# Altium project MB1397.PrjPcb (part 9 of 9)

## Sheet USB-TYPEC_CON.SchDoc: USB-TYPEC_CON
size A4; Date: Not used; ApprovedBy: Not used; CheckedBy: Not used; Author: Not used; CompanyName: STMicroelectronics; DrawnBy: Not used; Engineer: Not used; Organization: Not used; Address1: Not used; Address2: Not used; Address3: Not used; Address4: Not used; DocumentNumber: Not used; Revision: Not used; SheetNumber: 6; SheetTotal: 22; CurrentTime: Not used; CurrentDate: Not used; Time: Not used; DocumentFullPathAndName: Not used; DocumentName: Not used; ModifiedDate: Not used; ImagePath: Not used; ProjectName: Not used; Application_BuildNumber: Not used
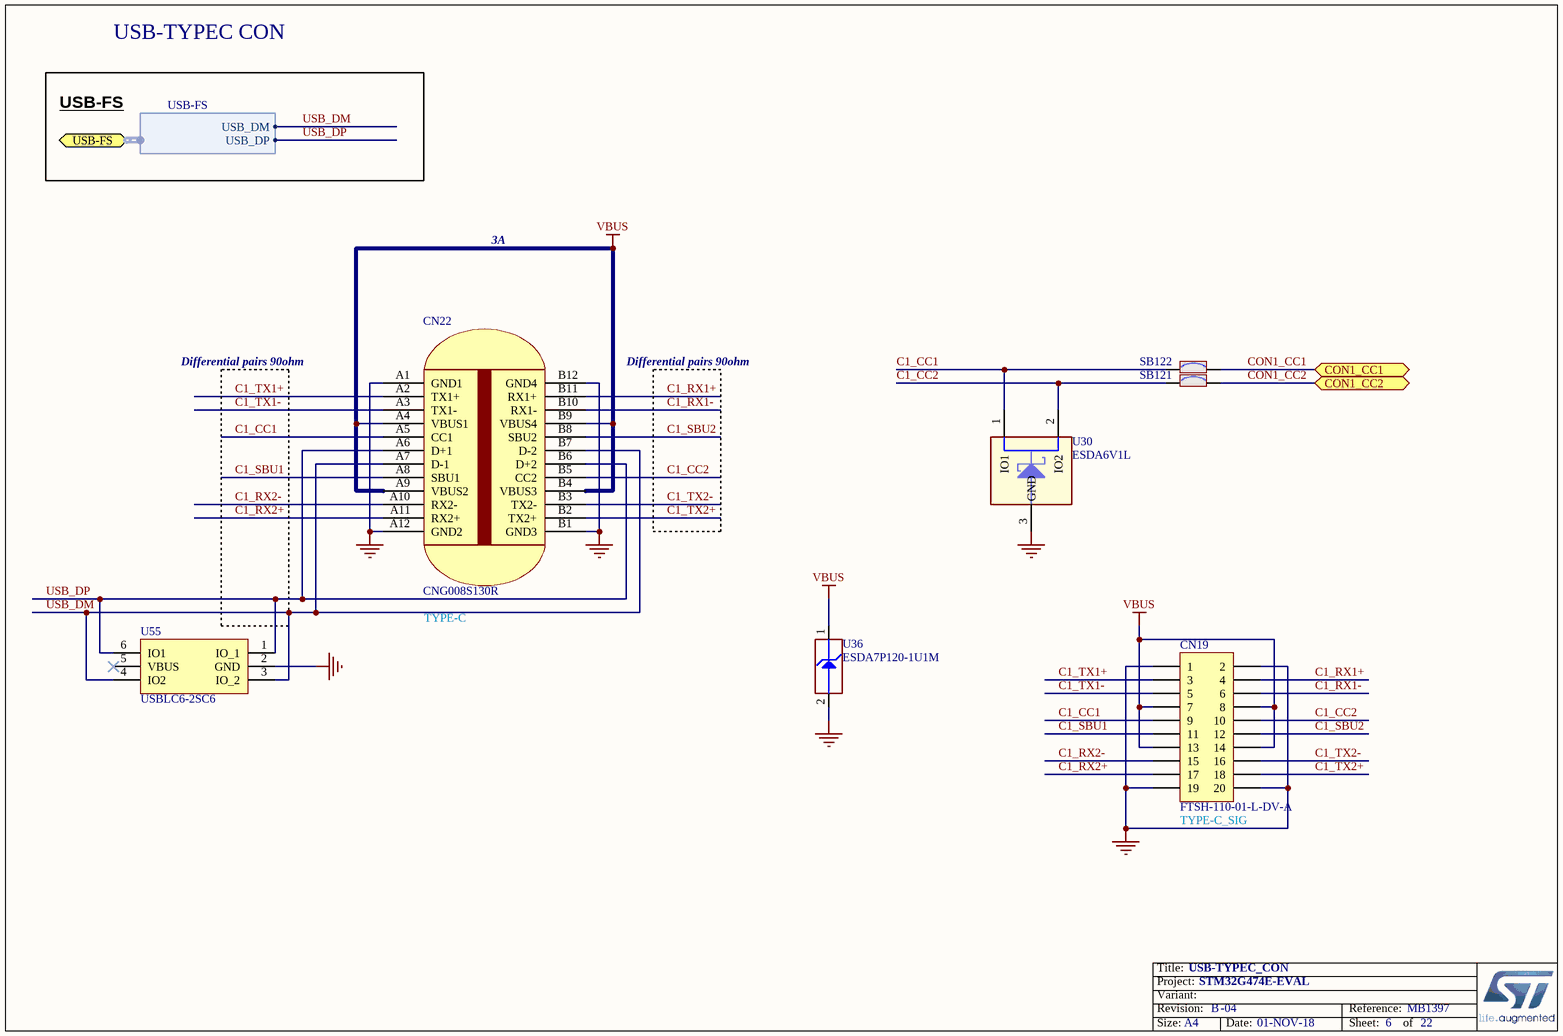
[diagram p21: USB-TYPEC_CON.SchDoc]

### Parts
CN19  value FTSH-110-01-L-DV-A  [CON_SAMTEC_FTSH-110-01-L-DV-A]  (hidden comment: Header 10x2)
CN22  value CNG008S130R  [CON_USB-TYPEC_LITKCONN-TECHNOLOGY_CNG008S130R]  (hidden comment: USB Type-C)
SB121  SB_ON  [SOLDER-BRIDGE_R0603-0R]  (value not drawn)
SB122  SB_ON  [SOLDER-BRIDGE_R0603-0R]  (value not drawn)
U30  value ESDA6V1L  [ESD_SOT23]  (hidden comment: ESDAxxL)
U36  value ESDA7P120-1U1M  [ESD_QFN1610_2N_1K_2A]  (hidden comment: ESD-TRANSIL)
U55  USBLC6-2SC6  [ESD_SOT23-6L]

### Ports
CON1_CC1, CON1_CC2, USB-FS (harness USB-FS)

### Harnesses
USB-FS: USB_DM, USB_DP

### Nets
GND: CN19.1 CN19.2 CN19.19 CN19.20 CN22.A1(GND1) CN22.A12(GND2) CN22.B1(GND3) CN22.B12(GND4) U30.3(GND) U36.2(GND) U55.2(GND)
VBUS: CN19.7 CN19.8 CN19.13 CN19.14 CN22.A4(VBUS1) CN22.A9(VBUS2) CN22.B4(VBUS3) CN22.B9(VBUS4) U36.1(IO1)
C1_CC1: CN19.9 CN22.A5(CC1) SB122.1 U30.1(IO1)
C1_CC2: CN19.10 CN22.B5(CC2) SB121.1 U30.2(IO2)
C1_RX1+: CN19.4 CN22.B11(RX1+)
C1_RX1-: CN19.6 CN22.B10(RX1-)
C1_RX2+: CN19.17 CN22.A11(RX2+)
C1_RX2-: CN19.15 CN22.A10(RX2-)
C1_SBU1: CN19.11 CN22.A8(SBU1)
C1_SBU2: CN19.12 CN22.B8(SBU2)
C1_TX1+: CN19.3 CN22.A2(TX1+)
C1_TX1-: CN19.5 CN22.A3(TX1-)
C1_TX2+: CN19.18 CN22.B2(TX2+)
C1_TX2-: CN19.16 CN22.B3(TX2-)
CON1_CC1: SB122.2 ; port CON1_CC1
CON1_CC2: SB121.2 ; port CON1_CC2
USB_DM: CN22.A7(D-1) CN22.B7(D-2) U55.3(IO_2) U55.4(IO2) ; port USB-FS.USB_DM
USB_DP: CN22.A6(D+1) CN22.B6(D+2) U55.1(IO_1) U55.6(IO1) ; port USB-FS.USB_DP

Not connected (* = marked no-connect by the designer): U55 5(VBUS)*

### Notes on the sheet
- USB-TYPEC CON
- USB-FS
- 3A
- Differential pairs 90ohm
- TYPE-C
- (near CN19) TYPE-C_SIG
- Title:
- Project:
- Size:
- Revision:
- Variant:
- A4
- -
- Date:
- Reference:
- Sheet:
- of

### Library data of the parts
CN19 = MCD-01561: Header 10x2, 1.27mm, VR, CMS, Height 3.05mm with alignment pin; Part_Type: Connector; Manufacturer: SAMTEC; Provided_By: SUBCO; Initial_Board_Reference: MB1397; Path: ws/MCD_ApplicationBoards/Lists/MCDPARTSdatabase; Item Type: Item; Remark: new part FTSH-110-01-L-DV-A to replace MCD-00557 footprint; Internal_Part_Number: MCD-01561; Status: New; Manufacturer_Part_Number: FTSH-110-01-L-DV-A; ComponentLink1Description: Datasheet; ComponentLink1URL: http://tunmcdsvn.tun.st.com/Component_Datasheet_Library/Trunk/Connectors/Samtec_FTSH_smt_series
CN22 = MCD-00678: USB Type C certified Connector SMT Mid-mount; Manufacturer: LITKCON TECHNOLOGY; Provided_By: SUBCO; Initial_Board_Reference: MB1272; Path: ws/MCD_ApplicationBoards/Lists/MCDPARTSdatabase; Item Type: Item; Internal_Part_Number: MCD-00678; Status: Footprint available; Part_Type: Connector; Manufacturer_Part_Number: CNG008S130R; ComponentLink1Description: Datasheet; ComponentLink1URL: http://tunmcdsvn.tun.st.com/Component_Datasheet_Library/Trunk/Connectors/LITKCON TECHNOLOGY_USBTypeC_CNG008S130R
SB121 SB122 = MCD-00071: Solder Bridge ON; Part_Type: Mechanical; Manufacturer_Part_Number: RC0603JR-070RL; Manufacturer: YAGEO; Provided_By: SUBCO; Initial_Board_Reference: MB1274; Path: ws/MCD_ApplicationBoards/Lists/MCDPARTSdatabase; Item Type: Item; Internal_Part_Number: MCD-00071; Status: Released; ComponentLink1Description: Datasheet; Package: SB0603; ComponentLink1URL: http://tunmcdsvn.tun.st.com/Component_Datasheet_Library/Trunk/Resistors/Yageo_Resistor_RC0603-series
U30 = MCD-00255: Dual Transil array ESD protection; Part_Type: Diode; Manufacturer: STMICROELECTRONICS; BMS_Part_Number: 9179033; Provided_By: SUBCO with ST control; Initial_Board_Reference: MB1311; Path: ws/MCD_ApplicationBoards/Lists/MCDPARTSdatabase; Item Type: Item; Internal_Part_Number: MCD-00255; Status: Released; Manufacturer_Part_Number: ESDA6V1L; ComponentLink1Description: Datasheet; ComponentLink1URL: http://tunmcdsvn.tun.st.com/Component_Datasheet_Library/Trunk/Diodes/STM_ESD_ESDAxxL
U36 = MCD-01026: High power transient voltage suppressor; Part_Type: Diode; Manufacturer: STMICROELECTRONICS; BMS_Part_Number: 9179046; Provided_By: SUBCO with ST control; Initial_Board_Reference: MB1378; Remark: Footprint moved fromROU lib: DFN105P160X60-2N to global-lib: ESD_QFN1610_2N_1K_2A; Path: ws/MCD_ApplicationBoards/Lists/MCDPARTSdatabase; Item Type: Item; Internal_Part_Number: MCD-01026; Status: Released; Manufacturer_Part_Number: ESDA7P120-1U1M; Package: QFN1610; ComponentLink1Description: Datasheet; ComponentLink1URL: http://tunmcdsvn.tun.st.com/Component_Datasheet_Library/Trunk/Diodes/STM_ESD_ESDA7P120-1U1M
U55 = MCD-00163: Very low capacitance ESD protection; Part_Type: IC; Manufacturer: STMICROELECTRONICS; BMS_Part_Number: 9151075; Provided_By: SUBCO with ST control; Initial_Board_Reference: MB1263; Path: ws/MCD_ApplicationBoards/Lists/MCDPARTSdatabase; Item Type: Item; Internal_Part_Number: MCD-00163; Value: USBLC6-2SC6; Status: Released; Manufacturer_Part_Number: USBLC6-2SC6; ComponentLink1Description: Datasheet; ComponentLink1URL: http://tunmcdsvn.tun.st.com/Component_Datasheet_Library/Trunk/Diodes/STM_ESD_USBLC6-2

## Nets that join several sheets
1V8: Audio (6 pins), Power_Board (SB42.2 TP4.1)
3V3: Audio (5 pins), LCD&SDcard (12 pins), MotorControl (10 pins), STM32_microcontroller_power (JP6.3 JP11.1), Power_Board (5 pins), Analog Interfaces (R111.2), Peripherals (LD1.1 LD2.1 LD3.1 LD4.1), RS232&RS485 (7 pins)
5V: FDCAN (C44.1 C53.1 U10.3 U15.3), LCD&SDcard (SB46.1), MotorControl (CN2.25 CN4.25), SmartCard (C152.1 C153.2 U42.6), Power_Board (11 pins), Analog Interfaces (C159.2 Q4.3 R318.2 U4.8), Multi-Function Expander (R241.2 T8.4), Peripherals (SB1.2 SB34.2), STLink_V3E_SWD (R277.2), ExtensionConnector (CN5.60 CN6.60)
5V_D: Power_Board (JP12.5), STLink_V3E_SWD (D4.1), ExtensionConnector (CN5.49 CN6.49)
5V_EXT: Power_Board (8 pins), STLink_V3E_SWD (D3.1), USB_PD (5 pins)
5V_STLK: Power_Board (JP12.1), STLink_V3E_SWD (SB41.2)
5V_USB_CHGR: Power_Board (JP12.9), STLink_V3E_SWD (8 pins)
5V_USB_PD: Power_Board (JP12.3), STLink_V3E_SWD (D5.1), USB_PD (D8.2 D9.2)
AGND: STM32_microcontroller_power (10 pins), Analog Interfaces (35 pins)
GND: FMC Memory (7 pins), Audio (33 pins), QSPI Memory (C51.1 C184.1 U12.10 U54.10), FDCAN (10 pins), LCD&SDcard (23 pins), MotorControl (49 pins), SmartCard (15 pins), STM32_microcontroller_power (33 pins), Power_Board (31 pins), HW_Mechanical_Parts (H1.1 H2.1 H5.1 H6.1), Analog Interfaces (5 pins), Multi-Function Expander (26 pins), Peripherals (17 pins), STLink_V3E_SWD (97 pins), ExtensionConnector (7 pins), USB_PD (10 pins), Debug connector (26 pins), RS232&RS485 (14 pins), USB-TYPEC_CON (11 pins)
VBUS: USB_PD (10 pins), USB-TYPEC_CON (9 pins)
VDD: STM32_microcontroller_IOs (R73.2 R80.2), FMC Memory (7 pins), Audio (5 pins), QSPI Memory (6 pins), FDCAN (C40.1 C52.1 U10.5 U15.5), LCD&SDcard (8 pins), SmartCard (8 pins), STM32_microcontroller_power (JP7.1 JP11.2 SW7.2), Analog Interfaces (C50.1 R158.2 R179.2 RV2.1), Multi-Function Expander (11 pins), Peripherals (6 pins), STLink_V3E_SWD (CN16.3 R282.2), ExtensionConnector (CN5.48 CN6.48), Debug connector (9 pins), RS232&RS485 (5 pins)
VDD_ADJ: STM32_microcontroller_power (JP11.3), Power_Board (SB48.2)
VDD_MCU: STM32_microcontroller_power (18 pins), Multi-Function Expander (JP13.2 SB43.2)
VREF_EXT: STM32_microcontroller_power (SB84.1), Analog Interfaces (5 pins)
A0: STM32_microcontroller_IOs (R136.2), FMC Memory (U11.A3), ExtensionConnector (CN6.51)
A1: STM32_microcontroller_IOs (R138.2), FMC Memory (U11.A4), ExtensionConnector (CN6.54)
A2: STM32_microcontroller_IOs (R132.2), FMC Memory (U11.A5), ExtensionConnector (CN6.46)
A3: STM32_microcontroller_IOs (R139.2), FMC Memory (U11.B3), ExtensionConnector (CN6.58)
A4: STM32_microcontroller_IOs (R140.2), FMC Memory (U11.B4), ExtensionConnector (CN6.57)
A5: STM32_microcontroller_IOs (R137.2), FMC Memory (U11.C3), ExtensionConnector (CN6.53)
A6: STM32_microcontroller_IOs (R93.2), FMC Memory (U11.C4), ExtensionConnector (CN6.30)
A7: STM32_microcontroller_IOs (R89.2), FMC Memory (U11.D4), ExtensionConnector (CN6.29)
A8: STM32_microcontroller_IOs (R88.2), FMC Memory (U11.H2), ExtensionConnector (CN6.28)
A9: STM32_microcontroller_IOs (R87.2), FMC Memory (U11.H3), ExtensionConnector (CN6.26)
A10: STM32_microcontroller_IOs (R48.2), FMC Memory (U11.H4), ExtensionConnector (CN5.22)
A11: STM32_microcontroller_IOs (R28.2), FMC Memory (U11.H5), ExtensionConnector (CN5.21)
A12: STM32_microcontroller_IOs (R50.2), FMC Memory (U11.G3), ExtensionConnector (CN5.18)
A13: STM32_microcontroller_IOs (R27.2), FMC Memory (U11.G4), ExtensionConnector (CN5.19)
A14: STM32_microcontroller_IOs (R53.2), FMC Memory (U11.F3), ExtensionConnector (CN5.17)
A15: STM32_microcontroller_IOs (R68.2), FMC Memory (U11.F4), ExtensionConnector (CN5.16)
A16: STM32_microcontroller_IOs (R39.2), FMC Memory (U11.E4), ExtensionConnector (CN6.7)
A17: STM32_microcontroller_IOs (R42.2), FMC Memory (U11.D3), ExtensionConnector (CN6.6)
A18: STM32_microcontroller_IOs (R41.2), FMC Memory (U11.H1), ExtensionConnector (CN6.5)
A19: STM32_microcontroller_IOs (R146.1), FMC Memory (R156.2 U11.G2), ExtensionConnector (CN5.54)
A20: STM32_microcontroller_IOs (R143.1), FMC Memory (R162.2 U11.H6), ExtensionConnector (CN5.56)
ADC_OUTN: STM32_microcontroller_IOs (SB27.1), Analog Interfaces (C35.1 R152.2)
Audio_INT: STM32_microcontroller_IOs (R43.2), Audio (U35.G3)
BK_Drive: STM32_microcontroller_IOs (R26.1), Peripherals (R175.1)
BOOT0: STM32_microcontroller_IOs (R123.1), STM32_microcontroller_power (JP8.2 R182.1)
CON1_CC1: STM32_microcontroller_IOs (SB21.2), USB_PD (JP15.3), USB-TYPEC_CON (SB122.2)
CON1_CC2: STM32_microcontroller_IOs (SB96.2), USB_PD (JP14.3), USB-TYPEC_CON (SB121.2)
D0: STM32_microcontroller_IOs (R29.2), FMC Memory (U11.B6), ExtensionConnector (CN6.4)
D1: STM32_microcontroller_IOs (R40.2), FMC Memory (U11.C5), ExtensionConnector (CN6.3)
D2: STM32_microcontroller_IOs (R83.2), FMC Memory (U11.C6), ExtensionConnector (CN5.27)
D3: STM32_microcontroller_IOs (R85.2), FMC Memory (U11.D5), ExtensionConnector (CN5.28)
D4: STM32_microcontroller_IOs (R84.1), FMC Memory (U11.E5), ExtensionConnector (CN6.27)
D5: STM32_microcontroller_IOs (R82.1), FMC Memory (U11.F5), ExtensionConnector (CN6.25)
D6: STM32_microcontroller_IOs (R79.1), FMC Memory (U11.F6), ExtensionConnector (CN6.24)
D7: STM32_microcontroller_IOs (R75.1), FMC Memory (U11.G6), ExtensionConnector (CN6.23)
D8: STM32_microcontroller_IOs (R71.1), FMC Memory (U11.B1), ExtensionConnector (CN6.22)
D9: STM32_microcontroller_IOs (R69.1), FMC Memory (U11.C1), ExtensionConnector (CN6.21)
D10: STM32_microcontroller_IOs (R63.1), FMC Memory (U11.C2), ExtensionConnector (CN6.20)
D11: STM32_microcontroller_IOs (R62.1), FMC Memory (U11.D2), ExtensionConnector (CN6.19)
D12: STM32_microcontroller_IOs (R60.1), FMC Memory (U11.E2), ExtensionConnector (CN6.18)
D13: STM32_microcontroller_IOs (R34.2), FMC Memory (U11.F2), ExtensionConnector (CN6.12)
D14: STM32_microcontroller_IOs (R37.2), FMC Memory (U11.F1), ExtensionConnector (CN6.9)
D15: STM32_microcontroller_IOs (R38.2), FMC Memory (U11.G1), ExtensionConnector (CN6.8)
DAC: STM32_microcontroller_IOs (SB25.1), Analog Interfaces (R153.2)
DISCHARGE: STM32_microcontroller_IOs (SB18.2), USB_PD (SB44.1)
FDCAN1_RX: STM32_microcontroller_IOs (JP1.2), FDCAN (U15.4)
FDCAN1_TX: STM32_microcontroller_IOs (R127.2), FDCAN (U15.1)
FDCAN2_RX: STM32_microcontroller_IOs (R112.2), FDCAN (U10.4)
FDCAN2_TX: STM32_microcontroller_IOs (SB5.2), FDCAN (U10.1)
FMC_NBL0: STM32_microcontroller_IOs (R148.1), FMC Memory (U11.A1), ExtensionConnector (CN5.55)
FMC_NBL1: STM32_microcontroller_IOs (R149.1), FMC Memory (U11.B2), ExtensionConnector (CN5.53)
FMC_NE1: STM32_microcontroller_IOs (R101.2), FMC Memory (R171.1 U11.B5), ExtensionConnector (CN5.40)
FMC_NOE: STM32_microcontroller_IOs (R94.2), FMC Memory (U11.A2), ExtensionConnector (CN5.33)
FMC_NWE: STM32_microcontroller_IOs (R97.2), FMC Memory (U11.G5), ExtensionConnector (CN5.38)
I2C3_SCL: STM32_microcontroller_IOs (R73.1 R74.2), Multi-Function Expander (R243.1), Peripherals (CN1.3 R17.1 U1.1 U1.6)
I2C3_SDA: STM32_microcontroller_IOs (R78.2 R80.1), Multi-Function Expander (R239.1), Peripherals (CN1.1 R13.1 U1.3 U1.4)
I2C3_SMBA: STM32_microcontroller_IOs (R70.2), Peripherals (R15.1 R16.1)
JTCK-SWCLK: STM32_microcontroller_IOs (R47.1), STLink_V3E_SWD (CN29.1 R206.2 U40.M11), Debug connector (R193.2)
JTDI: STM32_microcontroller_IOs (R54.1), STLink_V3E_SWD (R199.2), Debug connector (R185.2)
JTDO-SWO: STM32_microcontroller_IOs (R107.2), STLink_V3E_SWD (R204.2 U40.D12), Debug connector (R209.2)
JTMS-SWDIO: STM32_microcontroller_IOs (R44.1), STLink_V3E_SWD (CN29.2 R208.2 R285.2 U40.L2), Debug connector (R188.2)
JTRST: STM32_microcontroller_IOs (R109.1), Debug connector (R205.2)
LCD_CS: STM32_microcontroller_IOs (R49.1), LCD&SDcard (R216.1)
LED1: STM32_microcontroller_IOs (R81.2), Peripherals (R297.2)
LED3: STM32_microcontroller_IOs (R96.2), Peripherals (R299.2)
MC1_Ain: STM32_microcontroller_IOs (SB113.1), MotorControl (R64.2)
MC1_Bin: STM32_microcontroller_IOs (SB114.1), MotorControl (R55.2)
MC1_BusVoltage: STM32_microcontroller_IOs (SB115.1), MotorControl (C4.1 R3.2)
MC1_Cin: STM32_microcontroller_IOs (SB99.1), MotorControl (R52.2)
MC1_DissipativeBrake: STM32_microcontroller_IOs (SB97.1), MotorControl (CN2.23)
MC1_EnA: STM32_microcontroller_IOs (SB98.1), MotorControl (C3.2 CN2.31 SB2.1)
MC1_EnB: STM32_microcontroller_IOs (SB89.1), MotorControl (C9.2 CN2.33)
MC1_EnIndex: STM32_microcontroller_IOs (SB62.1 SB92.1), MotorControl (C11.2 CN2.34)
MC1_ICL_SHUTOUT: STM32_microcontroller_IOs (SB109.1), MotorControl (CN2.21)
MC1_MC2_PFC_Ind: STM32_microcontroller_IOs (SB55.1), MotorControl (C7.2 C29.2 R5.2 R113.2)
MC1_MC2_PFC_SD: STM32_microcontroller_IOs (SB17.1), MotorControl (R10.2 R128.2)
MC1_MC2_PFC_Vac: STM32_microcontroller_IOs (SB56.1), MotorControl (C10.2 C34.2 R12.2 R155.2)
MC1_MC2_PFCpwm: STM32_microcontroller_IOs (SB118.1), MotorControl (R11.1 R151.1)
MC1_MC2_PFCsync: STM32_microcontroller_IOs (SB103.1), MotorControl (R8.1 R126.1)
MC1_PWM_1H: STM32_microcontroller_IOs (SB78.1), MotorControl (CN2.3)
MC1_PWM_1L: STM32_microcontroller_IOs (SB79.1), MotorControl (CN2.5)
MC1_PWM_2H: STM32_microcontroller_IOs (SB76.1), MotorControl (CN2.7)
MC1_PWM_2L: STM32_microcontroller_IOs (SB77.1), MotorControl (CN2.9)
MC1_PWM_3H: STM32_microcontroller_IOs (SB73.1), MotorControl (CN2.11)
MC1_PWM_3L: STM32_microcontroller_IOs (SB74.1), MotorControl (CN2.13)
MC1_STOP: STM32_microcontroller_IOs (SB69.1), MotorControl (C1.2 CN2.1 R9.1)
MC1_Temp: STM32_microcontroller_IOs (SB100.1), MotorControl (C5.2 R7.2)
MC2_Ain: STM32_microcontroller_IOs (SB60.1), MotorControl (R103.2)
MC2_Bin: STM32_microcontroller_IOs (SB59.1), MotorControl (R99.2)
MC2_BusVoltage: STM32_microcontroller_IOs (SB72.1), MotorControl (C22.1 R77.2)
MC2_Cin: STM32_microcontroller_IOs (SB57.1), MotorControl (R119.2)
MC2_DissipativeBrake: STM32_microcontroller_IOs (SB112.1), MotorControl (CN4.23)
MC2_EnA: STM32_microcontroller_IOs (SB52.1), MotorControl (C37.2 CN4.31 SB32.1)
MC2_EnB: STM32_microcontroller_IOs (SB108.1), MotorControl (C42.2 CN4.33)
MC2_EnIndex: STM32_microcontroller_IOs (SB58.1 SB106.1), MotorControl (C39.2 CN4.34)
MC2_ICL_SHUTOUT: STM32_microcontroller_IOs (SB61.1), MotorControl (CN4.21)
MC2_PWM_1H: STM32_microcontroller_IOs (SB49.1), MotorControl (CN4.3)
MC2_PWM_1L: STM32_microcontroller_IOs (SB64.1), MotorControl (CN4.5)
MC2_PWM_2H: STM32_microcontroller_IOs (SB50.1), MotorControl (CN4.7)
MC2_PWM_2L: STM32_microcontroller_IOs (SB68.1), MotorControl (CN4.9)
MC2_PWM_3H: STM32_microcontroller_IOs (SB51.1), MotorControl (CN4.11)
MC2_PWM_3L: STM32_microcontroller_IOs (SB66.1), MotorControl (CN4.13)
MC2_STOP: STM32_microcontroller_IOs (SB23.1), MotorControl (R21.1)
MC2_Temp: STM32_microcontroller_IOs (SB83.1), MotorControl (C31.2 R120.2)
MC_DAC_OUT1: STM32_microcontroller_IOs (SB93.1), MotorControl (SW3.3 SW3.6 SW4.2)
MC_DAC_OUT2: STM32_microcontroller_IOs (SB24.1), MotorControl (CN32.1)
MFX_JOY_DOWN: Multi-Function Expander (U32.19), Peripherals (B1.3 U49.4)
MFX_JOY_LEFT: Multi-Function Expander (U32.20), Peripherals (B1.1 U49.6)
MFX_JOY_RIGHT: Multi-Function Expander (U32.39), Peripherals (B1.6 U49.3)
MFX_JOY_SEL: Multi-Function Expander (U32.18), Peripherals (B1.2 U49.5)
MFX_JOY_UP: Multi-Function Expander (U32.40), Peripherals (B1.4 U49.1)
MFX_SmartCard_1V8: SmartCard (R275.1 R276.2 U42.18), Multi-Function Expander (U32.29)
MFX_SmartCard_3/5V: SmartCard (U42.3), Multi-Function Expander (U32.30)
MFX_SmartCard_CMDVCC: SmartCard (U42.19), Multi-Function Expander (U32.32)
MFX_SmartCard_OFF: SmartCard (U42.23), Multi-Function Expander (U32.31)
MFX_SmartCard_RST: SmartCard (U42.20), Multi-Function Expander (U32.33)
NetC49_2: STM32_microcontroller_IOs (SB10.2), Peripherals (C49.2 R172.2)
NetC171_2: STM32_microcontroller_IOs (SB116.2), Analog Interfaces (C171.2 R310.2)
NetD2_1: STM32_microcontroller_power (D2.1), RS232&RS485 (U17.20)
NetJP18_2: STM32_microcontroller_power (JP18.2), RS232&RS485 (U17.16)
NetR312_1: STM32_microcontroller_power (R312.1), STLink_V3E_SWD (U40.F15)
NRST: STM32_microcontroller_IOs (U6.21), STM32_microcontroller_power (5 pins), Multi-Function Expander (D7.2), STLink_V3E_SWD (R196.2 U40.P3), ExtensionConnector (R309.2)
OPAMP1_INN: STM32_microcontroller_IOs (SB105.1), MotorControl (C20.1 R65.2 R67.2)
OPAMP1_INP: STM32_microcontroller_IOs (SB95.1), MotorControl (R61.2)
OPAMP1_OUT: STM32_microcontroller_IOs (SB117.1), MotorControl (C20.2 R67.1)
OPAMP2_IN1P: STM32_microcontroller_IOs (SB101.1), MotorControl (R31.2)
OPAMP2_IN2P: STM32_microcontroller_IOs (SB70.1), MotorControl (C15.1 R24.2 R25.1)
OPAMP2_INN: STM32_microcontroller_IOs (SB20.1), MotorControl (C19.1 R56.2 R57.2)
OPAMP2_OUT: STM32_microcontroller_IOs (SB104.1), MotorControl (C19.2 R57.1)
OPAMP3_INN: STM32_microcontroller_IOs (SB80.1), MotorControl (C27.1 R105.2 R106.2)
OPAMP3_INP: STM32_microcontroller_IOs (SB94.1), MotorControl (R125.2)
OPAMP3_OUT: STM32_microcontroller_IOs (SB91.1), MotorControl (C27.2 R105.1)
OPAMP4/COMP6_INP: STM32_microcontroller_IOs (SB8.2), Analog Interfaces (R164.1)
OPAMP4_IN1P: STM32_microcontroller_IOs (SB67.1), MotorControl (C14.1 R20.1 R22.2)
OPAMP4_IN2P: STM32_microcontroller_IOs (SB63.1), MotorControl (R91.2)
OPAMP4_INN: STM32_microcontroller_IOs (SB71.1), MotorControl (C17.1 R32.2 R33.2)
OPAMP4_OUT: STM32_microcontroller_IOs (SB65.1), MotorControl (C17.2 R33.1)
OPAMP4_VOUT: STM32_microcontroller_IOs (SB7.2), Analog Interfaces (RV1.2 RV1.3 TP2.1)
PA0: STM32_microcontroller_IOs (SB26.2 SB98.2 SB116.1 U6.27), ExtensionConnector (CN6.45)
PA1: STM32_microcontroller_IOs (SB27.2 SB95.2 U6.28), ExtensionConnector (CN6.44)
PA4: STM32_microcontroller_IOs (SB25.2 SB93.2 U6.33), ExtensionConnector (CN6.41)
PA5: STM32_microcontroller_IOs (SB24.2 U6.34), ExtensionConnector (CN6.40)
PA8: STM32_microcontroller_IOs (R30.2 U6.89), ExtensionConnector (CN5.2)
PA9: STM32_microcontroller_IOs (SB4.2 SB54.2 U6.90), ExtensionConnector (CN5.8)
PA10: STM32_microcontroller_IOs (SB3.2 SB53.2 U6.91), ExtensionConnector (CN5.4)
PA11: STM32_microcontroller_IOs (R46.2 U6.92), ExtensionConnector (CN5.3)
PA12: STM32_microcontroller_IOs (R45.2 U6.93), ExtensionConnector (CN5.5)
PA13: STM32_microcontroller_IOs (R44.2 U6.96), ExtensionConnector (CN5.6)
PA14: STM32_microcontroller_IOs (R47.2 U6.98), ExtensionConnector (CN5.9)
PA15: STM32_microcontroller_IOs (R54.2 SB62.2 U6.99), ExtensionConnector (CN5.12)
PB2: STM32_microcontroller_IOs (SB18.1 SB80.2 U6.41), ExtensionConnector (CN6.32)
PB3: STM32_microcontroller_IOs (R107.1 U6.118), ExtensionConnector (CN5.41)
PB4: STM32_microcontroller_IOs (R109.2 SB96.1 U6.119), ExtensionConnector (CN5.42)
PB5: STM32_microcontroller_IOs (R112.1 U6.120), ExtensionConnector (CN5.43)
PB6: STM32_microcontroller_IOs (SB21.1 U6.121), ExtensionConnector (CN5.44)
PB7: STM32_microcontroller_IOs (SB23.2 U6.122), ExtensionConnector (CN5.47)
PB8: STM32_microcontroller_IOs (JP1.1 R123.2 U6.123), ExtensionConnector (CN5.52)
PB9: STM32_microcontroller_IOs (R127.1 U6.124), ExtensionConnector (CN5.51)
PB10: STM32_microcontroller_IOs (SB11.1 SB71.2 U6.62), ExtensionConnector (CN6.17)
PB11: STM32_microcontroller_IOs (SB8.1 SB10.1 SB67.2 U6.65), ExtensionConnector (CN6.15)
PB12: STM32_microcontroller_IOs (SB7.1 SB65.2 U6.66), ExtensionConnector (CN6.16)
PB13: STM32_microcontroller_IOs (SB5.1 SB63.2 U6.67), ExtensionConnector (CN6.13)
PB14: STM32_microcontroller_IOs (R35.1 U6.68), ExtensionConnector (CN6.11)
PB15: STM32_microcontroller_IOs (R36.1 U6.69), ExtensionConnector (CN6.14)
PC0: STM32_microcontroller_IOs (SB29.2 SB99.2 U6.22), ExtensionConnector (CN5.46)
PC5: STM32_microcontroller_IOs (SB20.2 U6.38), ExtensionConnector (CN6.34)
PC6: STM32_microcontroller_IOs (SB9.2 SB49.2 U6.80), ExtensionConnector (CN6.2)
PC7: STM32_microcontroller_IOs (SB6.2 SB50.2 U6.81), ExtensionConnector (CN6.1)
PC8: STM32_microcontroller_IOs (R26.2 SB51.2 U6.87), ExtensionConnector (CN5.1)
PC9: STM32_microcontroller_IOs (R49.2 U6.88), ExtensionConnector (CN5.11)
PC10: STM32_microcontroller_IOs (SB12.2 SB64.2 U6.100), ExtensionConnector (CN5.13)
PC11: STM32_microcontroller_IOs (SB13.2 SB68.2 U6.101), ExtensionConnector (CN5.15)
PC12: STM32_microcontroller_IOs (SB15.2 SB66.2 U6.102), ExtensionConnector (CN5.14)
PC13: STM32_microcontroller_IOs (R141.2 U6.7), ExtensionConnector (CN5.57)
PC14: STM32_microcontroller_IOs (U6.8), STM32_microcontroller_power (R315.2), ExtensionConnector (SB88.1)
PC15: STM32_microcontroller_IOs (U6.9), STM32_microcontroller_power (R314.2), ExtensionConnector (SB87.2)
PD2: STM32_microcontroller_IOs (SB17.2 SB123.1 U6.112), ExtensionConnector (CN5.29)
PD6: STM32_microcontroller_IOs (R98.1 U6.116), ExtensionConnector (CN5.37)
PD_DBCC1: STM32_microcontroller_IOs (SB54.1), USB_PD (JP15.2)
PD_DBCC2: STM32_microcontroller_IOs (SB53.1), USB_PD (JP14.2)
PE2: STM32_microcontroller_IOs (R147.2 SB103.2 SB111.2 U6.1), ExtensionConnector (CN5.50)
PE5: STM32_microcontroller_IOs (SB28.2 SB97.2 U6.4), ExtensionConnector (CN5.45)
PE6: STM32_microcontroller_IOs (R142.2 U6.5), ExtensionConnector (CN5.58)
PF0: STM32_microcontroller_IOs (U6.19), STM32_microcontroller_power (C172.1 R312.2 R317.2), ExtensionConnector (SB82.1)
PF1: STM32_microcontroller_IOs (U6.20), STM32_microcontroller_power (R313.2), ExtensionConnector (SB81.2)
PF6: STM32_microcontroller_IOs (R43.1 SB52.2 U6.97), ExtensionConnector (CN5.7)
PF8: STM32_microcontroller_IOs (R135.1 SB106.2 U6.16), ExtensionConnector (CN6.56)
PF9: STM32_microcontroller_IOs (R134.1 U6.17), ExtensionConnector (CN6.55)
PF11: STM32_microcontroller_IOs (R96.1 U6.48), ExtensionConnector (CN6.31)
PG6: STM32_microcontroller_IOs (R70.1 U6.104), ExtensionConnector (CN5.24)
PG7: STM32_microcontroller_IOs (R74.1 U6.105), ExtensionConnector (CN5.23)
PG8: STM32_microcontroller_IOs (R78.1 U6.106), ExtensionConnector (CN5.25)
PG9: STM32_microcontroller_IOs (R81.1 U6.107), ExtensionConnector (CN5.26)
QSPI_BK1_IO0: STM32_microcontroller_IOs (R102.2), QSPI Memory (R173.2), ExtensionConnector (CN6.33)
QSPI_BK1_IO1: STM32_microcontroller_IOs (R108.2), QSPI Memory (R159.1), ExtensionConnector (CN6.35)
QSPI_BK1_IO2: STM32_microcontroller_IOs (R118.1), QSPI Memory (R160.2), ExtensionConnector (CN6.37)
QSPI_BK1_IO3: STM32_microcontroller_IOs (R121.1), QSPI Memory (R178.1), ExtensionConnector (CN6.38)
QSPI_BK1_NCS: STM32_microcontroller_IOs (R150.1), QSPI Memory (R161.2 SB35.1 U12.7), ExtensionConnector (CN6.43)
QSPI_BK2_IO0: STM32_microcontroller_IOs (R130.1), QSPI Memory (R170.2 R320.2), ExtensionConnector (CN6.52)
QSPI_BK2_IO1: STM32_microcontroller_IOs (R133.1), QSPI Memory (R168.1 R321.1), ExtensionConnector (CN6.50)
QSPI_BK2_IO2: STM32_microcontroller_IOs (R131.1), QSPI Memory (R167.2 R322.2), ExtensionConnector (CN6.47)
QSPI_BK2_IO3: STM32_microcontroller_IOs (R116.1), QSPI Memory (R169.1 R319.1), ExtensionConnector (CN6.36)
QSPI_BK2_NCS: STM32_microcontroller_IOs (R90.2), QSPI Memory (R166.2 SB120.1 U54.7), ExtensionConnector (CN5.34)
QSPI_CLK: STM32_microcontroller_IOs (R129.1), QSPI Memory (SB36.2 SB119.2 U12.16), ExtensionConnector (CN6.42)
RS485_DIR: STM32_microcontroller_IOs (SB123.2), RS232&RS485 (R201.1 U23.3)
SAI_FS_A: STM32_microcontroller_IOs (SB107.1), Audio (U35.E3)
SAI_MCLK_A: STM32_microcontroller_IOs (SB111.1), Audio (U35.D3)
SAI_SCK_A: STM32_microcontroller_IOs (R30.1), Audio (U35.G1)
SAI_SD_A: STM32_microcontroller_IOs (R98.2), Audio (U35.E4)
SAI_SD_B: STM32_microcontroller_IOs (SB110.1), Audio (U35.F2)
SmartCard_CLK: STM32_microcontroller_IOs (SB15.1), SmartCard (U42.24)
SmartCard_IO: STM32_microcontroller_IOs (SB12.1), SmartCard (U42.26)
SOURCE_EN: STM32_microcontroller_IOs (SB13.1), USB_PD (R264.2 T10.3)
SPI2_MISO: STM32_microcontroller_IOs (R35.2), LCD&SDcard (5 pins)
SPI2_MOSI: STM32_microcontroller_IOs (R36.2), LCD&SDcard (U28.2)
SPI2_SCK: STM32_microcontroller_IOs (R134.2), LCD&SDcard (R218.1 U26.2)
TAMPER_KEY: STM32_microcontroller_IOs (R141.1), Peripherals (5 pins)
TRACECLK: STM32_microcontroller_IOs (R147.1), Debug connector (CN17.12 U20.1)
TRACED0: STM32_microcontroller_IOs (R145.1), Debug connector (CN17.14 R210.1 U24.5)
TRACED1: STM32_microcontroller_IOs (R144.1), Debug connector (CN17.16 R207.1 U24.4)
TRACED2: STM32_microcontroller_IOs (SB28.1), Debug connector (CN17.18 U24.3)
TRACED3: STM32_microcontroller_IOs (R142.1), Debug connector (CN17.20 U24.1)
USART1_RX: STM32_microcontroller_IOs (SB3.1), RS232&RS485 (JP9.2)
USART1_TX: STM32_microcontroller_IOs (SB4.1), RS232&RS485 (SB40.1)
USB_DM: STM32_microcontroller_IOs (R46.1), USB-TYPEC_CON (CN22.A7 CN22.B7 U55.3 U55.4)
USB_DP: STM32_microcontroller_IOs (R45.1), USB-TYPEC_CON (CN22.A6 CN22.B6 U55.1 U55.6)
uSD_CS: STM32_microcontroller_IOs (R135.2), LCD&SDcard (CN28.2 R287.1 U46.4 U46.7)
VSENSE: STM32_microcontroller_IOs (SB29.1), USB_PD (C185.2 R244.1 R323.2)

## Assembly variants
G474E: not fitted C2 C3 C6 C8 C9 C10 C11 C17 C19 C20 C23 C24 C26 C27 C29 C31 C33 C34 C36 C37 C39 C42 C46 C172 CN7 CN8 CN15 CN18 CN27 CN29 CN30 L1 R32 R33 R56 R57 R65 R67 R105 R106 R113 R126 R128 R151 R155 R158 R167 R168 R169 R170 R183 R184 R186 R195 R197 R199 R200 R207 R210 R224 R225 R235 R240 R261 R275 R276 R286 R294 R312; alternate parts SB35 -> SB_OFF, SB8 -> SB_OFF, SB10 -> SB_ON
G474EMC: not fitted C2 C3 C6 C8 C9 C10 C11 C23 C24 C26 C29 C31 C33 C34 C36 C37 C39 C42 C46 C172 CN7 CN8 CN15 CN18 CN27 CN29 CN30 L1 R26 R29 R34 R37 R38 R40 R41 R42 R43 R60 R62 R63 R69 R71 R75 R79 R82 R84 R94 R101 R102 R108 R113 R116 R118 R121 R126 R128 R129 R130 R131 R133 R135 R138 R143 R146 R150 R151 R155 R158 R167 R168 R169 R170 R183 R184 R186 R195 R197 R199 R200 R207 R210 R224 R225 R235 R240 R261 R275 R276 R286 R294 R312; alternate parts SB35 -> SB_OFF, SB69 -> SB_ON, SB73 -> SB_ON, SB74 -> SB_ON, SB76 -> SB_ON, SB78 -> SB_ON, SB77 -> SB_ON, SB79 -> SB_ON, SB89 -> SB_ON, SB92 -> SB_ON, SB98 -> SB_ON, SB26 -> SB_OFF, SB103 -> SB_ON, SB118 -> SB_ON, SB17 -> SB_ON, SB110 -> SB_OFF, SB97 -> SB_ON, SB109 -> SB_ON, SB100 -> SB_ON, SB115 -> SB_ON, SB55 -> SB_ON, SB56 -> SB_ON, SB49 -> SB_ON, SB64 -> SB_ON, SB50 -> SB_ON, SB68 -> SB_ON, SB66 -> SB_ON, SB51 -> SB_ON, SB52 -> SB_ON, SB108 -> SB_ON, SB106 -> SB_ON, SB112 -> SB_ON, SB61 -> SB_ON, SB72 -> SB_ON, SB83 -> SB_ON, SB93 -> SB_ON, SB113 -> SB_ON, SB114 -> SB_ON, SB99 -> SB_ON, SB57 -> SB_ON, SB59 -> SB_ON, SB60 -> SB_ON, SB95 -> SB_ON, SB105 -> SB_ON, SB117 -> SB_ON, SB101 -> SB_ON, SB70 -> SB_ON, SB67 -> SB_ON, SB104 -> SB_ON, SB63 -> SB_ON, SB71 -> SB_ON, SB65 -> SB_ON, SB94 -> SB_ON, SB91 -> SB_ON, SB80 -> SB_ON, SB12 -> SB_OFF, SB29 -> SB_OFF, SB27 -> SB_OFF, SB5 -> SB_OFF, SB7 -> SB_OFF, SB8 -> SB_OFF, SB11 -> SB_OFF, SB18 -> SB_OFF, SB9 -> SB_OFF, SB123 -> SB_OFF
G484E: not fitted C2 C3 C6 C8 C9 C10 C11 C17 C19 C20 C23 C24 C26 C27 C29 C31 C33 C34 C36 C37 C39 C42 C46 C172 CN7 CN8 CN15 CN18 CN27 CN29 CN30 L1 R32 R33 R56 R57 R65 R67 R105 R106 R113 R126 R128 R151 R155 R158 R167 R168 R169 R170 R183 R184 R186 R195 R197 R199 R200 R207 R210 R224 R225 R235 R240 R261 R275 R276 R286 R294 R312; alternate parts SB35 -> SB_OFF, SB8 -> SB_OFF, SB10 -> SB_ON, U6 -> =Value